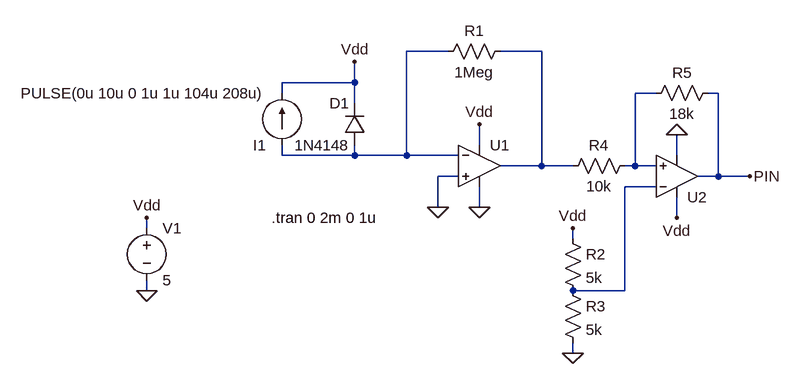
[diagram p0: schematic ProjectRxPulse.asc]
ProjectRxPulse.asc, the LTspice schematic file:
Version 4.1
SHEET 1 972 5168
WIRE 64 16 0 16
WIRE 208 16 144 16
WIRE -80 64 -80 32
WIRE -80 64 -192 64
WIRE -192 80 -192 64
WIRE 384 80 352 80
WIRE 480 80 464 80
WIRE -80 96 -80 64
WIRE 112 160 112 128
WIRE -192 176 -192 160
WIRE -80 176 -80 160
WIRE -80 176 -192 176
WIRE 0 176 0 16
WIRE 0 176 -80 176
WIRE 80 176 0 176
WIRE 416 176 416 144
WIRE 208 192 208 16
WIRE 208 192 144 192
WIRE 256 192 208 192
WIRE 352 192 352 80
WIRE 352 192 336 192
WIRE 384 192 352 192
WIRE 80 208 48 208
WIRE 480 208 480 80
WIRE 480 208 448 208
WIRE 528 208 480 208
WIRE 384 224 336 224
WIRE 48 256 48 208
WIRE 112 256 112 224
WIRE 416 272 416 240
WIRE -400 288 -400 272
WIRE 256 304 256 288
WIRE -400 384 -400 368
WIRE 336 384 336 224
WIRE 336 384 256 384
WIRE 256 480 256 464
FLAG 528 208 PIN
FLAG -400 384 0
FLAG -400 272 Vdd
FLAG 256 480 0
FLAG 256 288 Vdd
FLAG -80 32 Vdd
FLAG 112 128 Vdd
FLAG 416 272 Vdd
FLAG 112 256 0
FLAG 416 144 0
FLAG 48 256 0
SYMBOL res 160 0 R90
WINDOW 0 0 56 VBottom 2
WINDOW 3 32 56 VTop 2
SYMATTR InstName R1
SYMATTR Value 1Meg
SYMBOL voltage -400 272 R0
WINDOW 123 0 0 Left 0
WINDOW 39 0 0 Left 0
SYMATTR InstName V1
SYMATTR Value 5
SYMBOL res 240 288 R0
SYMATTR InstName R2
SYMATTR Value 5k
SYMBOL res 240 368 R0
SYMATTR InstName R3
SYMATTR Value 5k
SYMBOL current -192 160 R180
WINDOW 123 0 0 Left 0
WINDOW 39 0 0 Left 0
SYMATTR InstName I1
SYMATTR Value PULSE(0u 10u 0 1u 1u 104u 208u)
SYMBOL OpAmps\\UniversalOpAmp2 112 192 R0
SYMATTR InstName U1
SYMATTR Value2 Avol=1Meg GBW=2.8Meg Slew=2.3Meg
SYMBOL OpAmps\\UniversalOpAmp2 416 208 M180
SYMATTR InstName U2
SYMATTR Value2 Avol=1Meg GBW=2.8Meg Slew=2.3Meg
SYMBOL diode -64 160 R180
WINDOW 0 24 64 Left 2
WINDOW 3 24 0 Left 2
SYMATTR InstName D1
SYMATTR Value 1N4148
SYMBOL res 352 176 R90
WINDOW 0 0 56 VBottom 2
WINDOW 3 32 56 VTop 2
SYMATTR InstName R4
SYMATTR Value 10k
SYMBOL res 480 64 R90
WINDOW 0 0 56 VBottom 2
WINDOW 3 32 56 VTop 2
SYMATTR InstName R5
SYMATTR Value 18k
TEXT -208 272 Left 2 !.tran 0 2m 0 1u

The netlist it stands for:
* ProjectRxPulse.asc
R1 N002 N001 1Meg
V1 Vdd 0 5
R2 Vdd N004 5k
R3 N004 0 5k
I1 N001 Vdd PULSE(0u 10u 0 1u 1u 104u 208u)
X§U1 0 N001 Vdd 0 N002 level2 Avol=1Meg GBW=2.8Meg Slew=2.3Meg Ilimit=25m Rail=0 Vos=0 En=0 Enk=0 In=0 Ink=0 Rin=500Meg  ; pins In+ In- V+ V- OUT
X§U2 N003 N004 Vdd 0 PIN level2 Avol=1Meg GBW=2.8Meg Slew=2.3Meg Ilimit=25m Rail=0 Vos=0 En=0 Enk=0 In=0 Ink=0 Rin=500Meg  ; pins In+ In- V+ V- OUT
D1 N001 Vdd 1N4148
R4 N003 N002 10k
R5 PIN N003 18k
.model D D
.lib standard.dio
.tran 0 2m 0 1u
.lib UniversalOpAmp2.lib
.backanno
.end